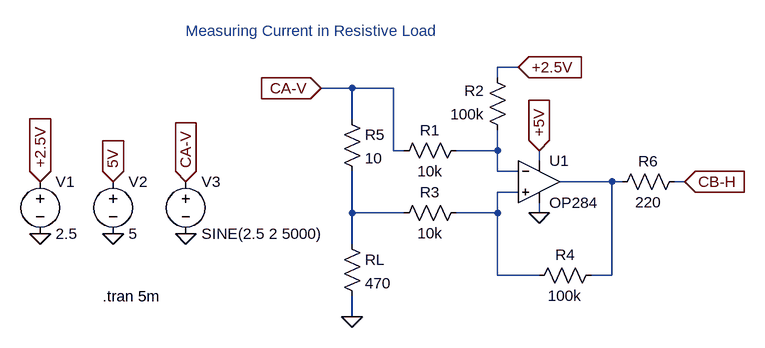
[diagram p0: schematic measuring_current_res_load_ltspice.asc]
measuring_current_res_load_ltspice.asc, the LTspice schematic file:
Version 4
SHEET 1 880 680
WIRE 368 208 336 208
WIRE 336 224 336 208
WIRE 112 240 64 240
WIRE 176 240 112 240
WIRE 112 288 112 240
WIRE 176 336 176 240
WIRE 192 336 176 336
WIRE 336 336 336 304
WIRE 336 336 272 336
WIRE 400 352 400 336
WIRE 336 368 336 336
WIRE 368 368 336 368
WIRE 512 384 432 384
WIRE 528 384 512 384
WIRE 624 384 608 384
WIRE 368 400 336 400
WIRE 112 432 112 368
WIRE 192 432 112 432
WIRE 336 432 336 400
WIRE 336 432 272 432
WIRE 400 432 400 416
WIRE 112 480 112 432
WIRE 336 528 336 432
WIRE 400 528 336 528
WIRE 512 528 512 384
WIRE 512 528 480 528
WIRE 112 592 112 560
FLAG 400 432 0
FLAG 400 336 +5V
IOPIN 400 336 In
FLAG 64 240 CA-V
IOPIN 64 240 In
FLAG 368 208 +2.5V
IOPIN 368 208 In
FLAG 624 384 CB-H
IOPIN 624 384 In
FLAG 112 592 0
FLAG -368 464 0
FLAG -256 464 0
FLAG -144 464 0
FLAG -368 384 +2.5V
IOPIN -368 384 In
FLAG -256 384 5V
IOPIN -256 384 In
FLAG -144 384 CA-V
IOPIN -144 384 In
SYMBOL Opamps\\OP284 400 320 R0
SYMATTR InstName U1
SYMBOL res 288 320 R90
WINDOW 0 0 56 VBottom 2
WINDOW 3 32 56 VTop 2
SYMATTR InstName R1
SYMATTR Value 10k
SYMBOL res 352 320 R180
WINDOW 0 36 76 Left 2
WINDOW 3 36 40 Left 2
SYMATTR InstName R2
SYMATTR Value 100k
SYMBOL res 176 448 R270
WINDOW 0 32 56 VTop 2
WINDOW 3 0 56 VBottom 2
SYMATTR InstName R3
SYMATTR Value 10k
SYMBOL res 384 544 R270
WINDOW 0 32 56 VTop 2
WINDOW 3 0 56 VBottom 2
SYMATTR InstName R4
SYMATTR Value 100k
SYMBOL res 96 272 R0
SYMATTR InstName R5
SYMATTR Value 10
SYMBOL res 624 368 R90
WINDOW 0 0 56 VBottom 2
WINDOW 3 32 56 VTop 2
SYMATTR InstName R6
SYMATTR Value 220
SYMBOL res 96 464 R0
SYMATTR InstName RL
SYMATTR Value 470
SYMBOL voltage -368 368 R0
WINDOW 123 0 0 Left 0
WINDOW 39 0 0 Left 0
SYMATTR InstName V1
SYMATTR Value 2.5
SYMBOL voltage -256 368 R0
WINDOW 123 0 0 Left 0
WINDOW 39 0 0 Left 0
SYMATTR InstName V2
SYMATTR Value 5
SYMBOL voltage -144 368 R0
WINDOW 123 0 0 Left 0
WINDOW 39 0 0 Left 0
SYMATTR InstName V3
SYMATTR Value SINE(2.5 2 5000)
TEXT -144 152 Left 2 ;Measuring Current in Resistive Load
TEXT -272 560 Left 2 !.tran 5m

The netlist it stands for:
* measuring_current_res_load_ltspice.asc
XU1 N003 N001 +5V 0 N002 OP284  ; pins In+ In- V+ V- OUT
R1 N001 CA-V 10k
R2 N001 +2.5V 100k
R3 N004 N003 10k
R4 N003 N002 100k
R5 CA-V N004 10
R6 CB-H N002 220
RL N004 0 470
V1 +2.5V 0 2.5
V2 5V 0 5
V3 CA-V 0 SINE(2.5 2 5000)
* Measuring Current in Resistive Load
.tran 5m
.lib ADI1.lib
.backanno
.end